# EAGLE schematic Adafruit nRF52 Bluefruit Feather (EAGLE 8.5.1)
COMPANY: ADAFRUIT INDUSTRIES; DRAWN: KTOWN; REV: F
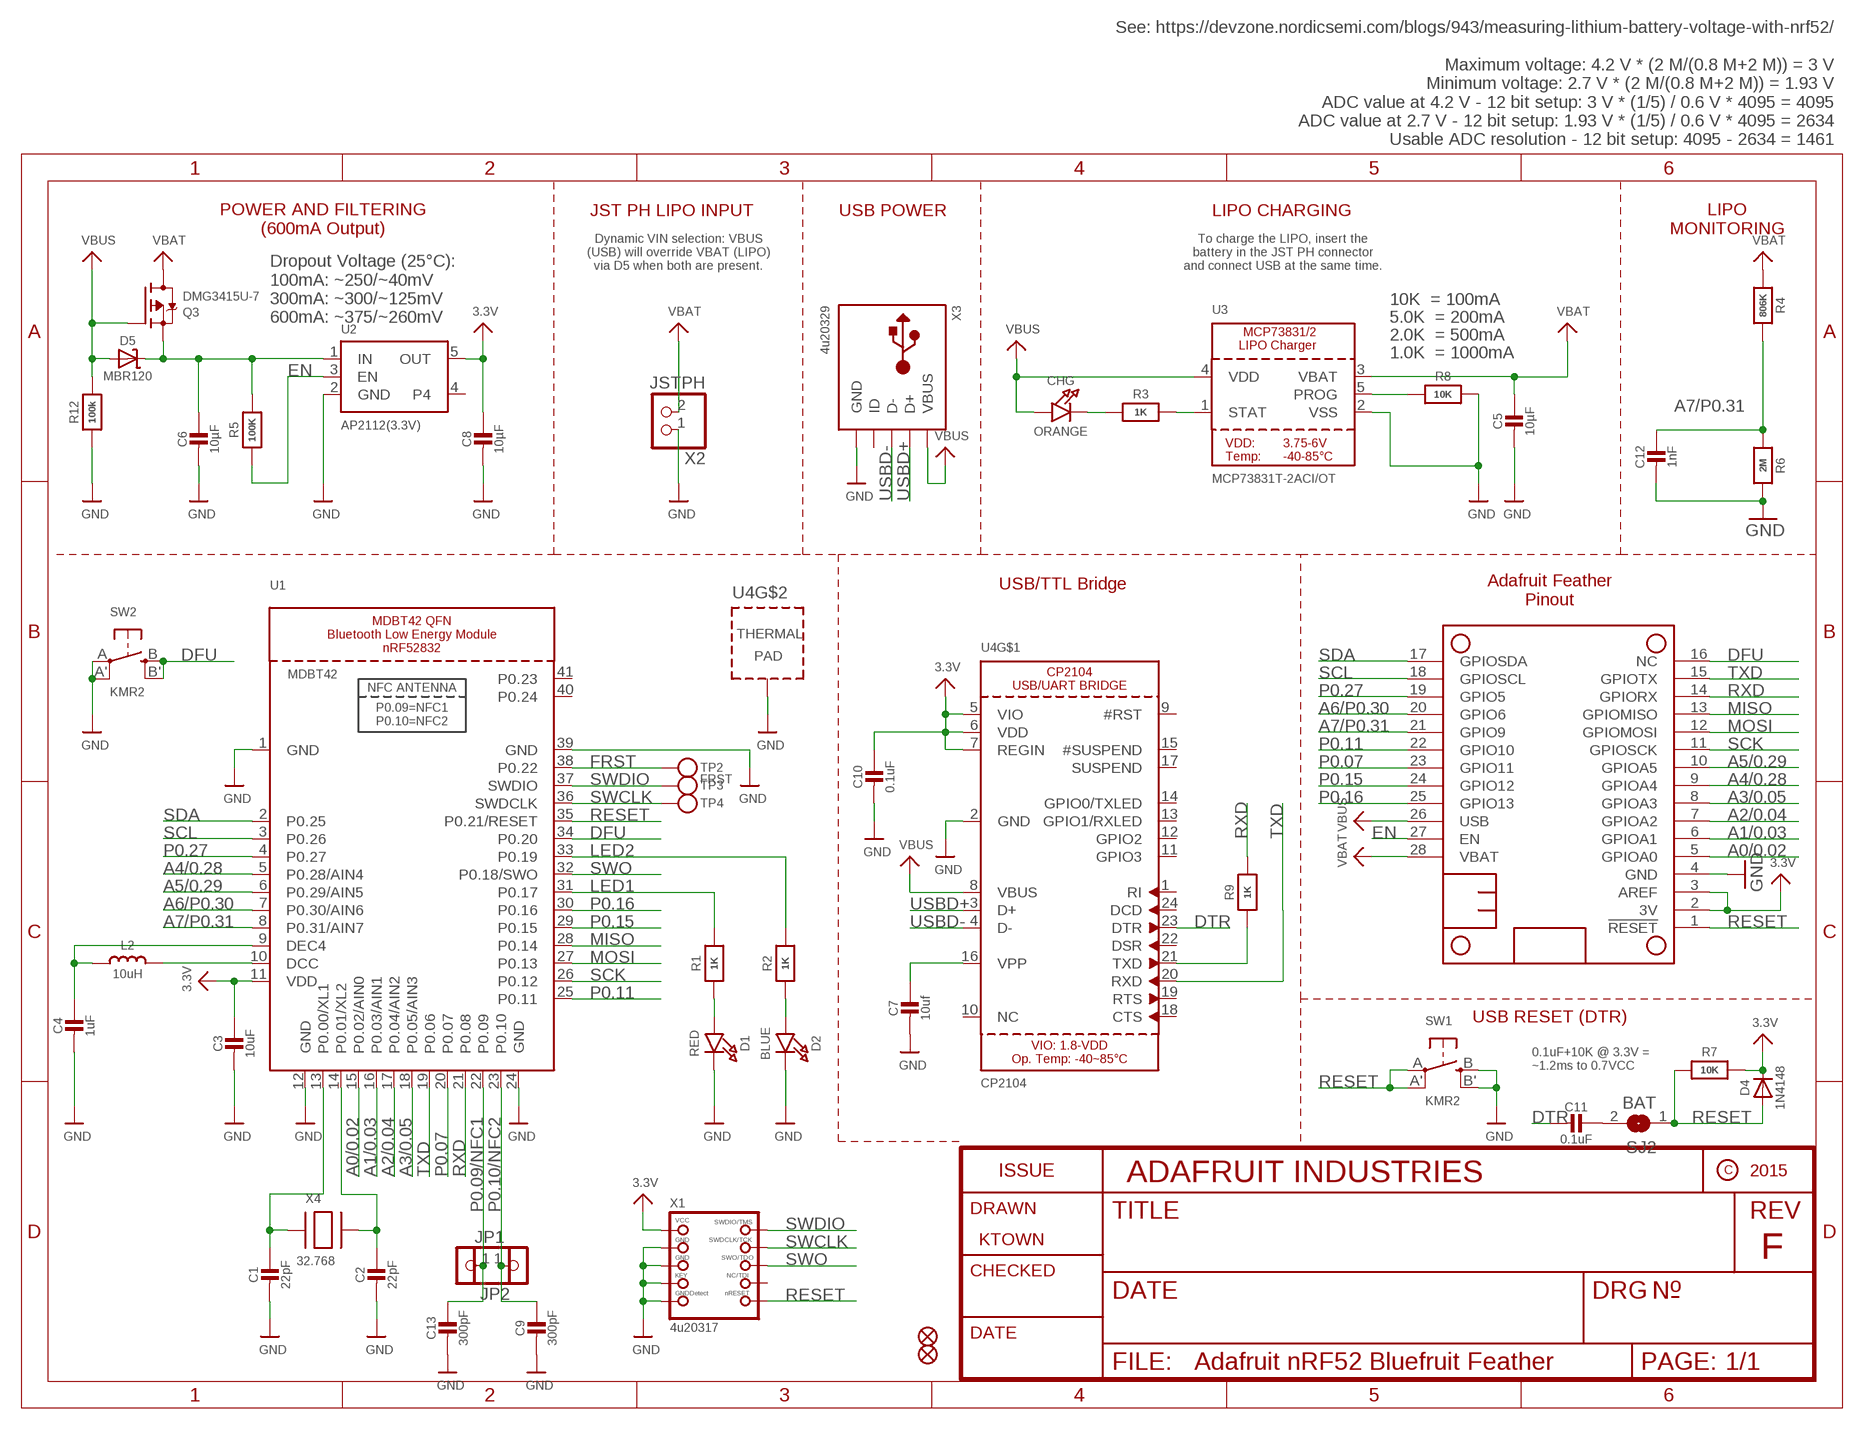
[diagram p0: schematic, sheet 1]

## Parts
C1  22pF  CAP_CERAMIC0603_NO  [0603-NO]
C2  22pF  CAP_CERAMIC0603_NO  [0603-NO]
C3  10uF  CAP_CERAMIC0805-NOOUTLINE  [0805-NO]
C4  1uF  CAP_CERAMIC0603_NO  [0603-NO]
C5  10µF  CAP_CERAMIC0805-NOOUTLINE  [0805-NO]
C6  10µF  CAP_CERAMIC0805-NOOUTLINE  [0805-NO]
C7  10uf  CAP_CERAMIC0805-NOOUTLINE  [0805-NO]
C8  10µF  CAP_CERAMIC0805-NOOUTLINE  [0805-NO]
C9  300pF  CAP_CERAMIC_0603MP  [_0603MP]
C10  0.1uF  CAP_CERAMIC0603_NO  [0603-NO]
C11  0.1uF  CAP_CERAMIC0603_NO  [0603-NO]
C12  1nF  CAP_CERAMIC0603_NO  [0603-NO]
C13  300pF  CAP_CERAMIC_0603MP  [_0603MP]
CHG  ORANGE  LED0805_NOOUTLINE  [CHIPLED_0805_NOOUTLINE]
D1  RED  LED0805_NOOUTLINE  [CHIPLED_0805_NOOUTLINE]
D2  BLUE  LED0805_NOOUTLINE  [CHIPLED_0805_NOOUTLINE]
D4  1N4148  DIODESOD-323  [SOD-323]
D5  MBR120  DIODE-SCHOTTKYSOD-123  [SOD-123]
FID1  FIDUCIAL_1MM  [FIDUCIAL_1MM]
FID3  FIDUCIAL_1MM  [FIDUCIAL_1MM]
JP1  HEADER-1X12MM  [1X01_2MM]
JP2  HEADER-1X12MM  [1X01_2MM]
L2  10uH  INDUCTOR0805-NO  [0805-NO]
MS1  FEATHERWING_NODIM  [FEATHERWING_NODIM]
Q3  DMG3415U-7  MOSFET-P  [SOT23-R]
R1  1K  RESISTOR_0603_NOOUT  [0603-NO]
R2  1K  RESISTOR_0603_NOOUT  [0603-NO]
R3  1K  RESISTOR_0603_NOOUT  [0603-NO]
R4  806K  RESISTOR_0603_NOOUT  [0603-NO]
R5  100K  RESISTOR_0603_NOOUT  [0603-NO]
R6  2M  RESISTOR_0603_NOOUT  [0603-NO]
R7  10K  RESISTOR_0603_NOOUT  [0603-NO]
R8  10K  RESISTOR_0603_NOOUT  [0603-NO]
R9  1K  RESISTOR_0603_NOOUT  [0603-NO]
R12  100k  RESISTOR_0603_NOOUT  [0603-NO]
SJ2  BAT  SOLDERJUMPERCLOSED  [SOLDERJUMPER_CLOSEDWIRE]
SW1  KMR2  SWITCH_TACT_SMT4.6X2.8  [BTN_KMR2_4.6X2.8]
SW2  KMR2  SWITCH_TACT_SMT4.6X2.8  [BTN_KMR2_4.6X2.8]
TP2  FRST  TESTPOINT1.5X2.0MM_NOCREAM  [PAD-1.5X2.0]
TP3  TESTPOINTROUND2MM  [TESTPOINT_ROUND_2MM]
TP4  TESTPOINTROUND2MM  [TESTPOINT_ROUND_2MM]
U1  MDBT42  NRF52832_MODULE_MDBT42  [BLE_MODULE_RAYTAC_MDBT42]
U2  AP2112(3.3V)  VREG_SOT23-5  [SOT23-5]
U3  MCP73831T-2ACI/OT  MCP73831/2  [SOT23-5]
U4  CP2104  [QFN24_4MM_SMSC]
X1  4u20317  JTAG-CORTEXBOXPOSTS  [2X05_1.27MM_BOX_POSTS]
X2  JSTPH  CON_JST_PH_2PIN  [JSTPH2]
X3  4u20329  USB_MICRO_20329_V2  [4UCONN_20329_V2]
X4  32.768  XTAL-3.2X1.5  [XTAL3215]

## Nets
3.3V: C3.1 C8.1 C10.1 D4.C MS1.2(3V) MS1.3(AREF) R7.2 U1.11(VDD) U2.5(OUT) U4.5(VIO) U4.6(VDD) U4.7(REGIN) X1.1(VCC)
A0/0.02: MS1.5(GPIOA0) U1.15(P0.02/AIN0)
A1/0.03: MS1.6(GPIOA1) U1.16(P0.03/AIN1)
A2/0.04: MS1.7(GPIOA2) U1.17(P0.04/AIN2)
A3/0.05: MS1.8(GPIOA3) U1.18(P0.05/AIN3)
A4/0.28: MS1.9(GPIOA4) U1.5(P0.28/AIN4)
A5/0.29: MS1.10(GPIOA5) U1.6(P0.29/AIN5)
A6/P0.30: MS1.20(GPIO6) U1.7(P0.30/AIN6)
A7/P0.31: C12.1 MS1.21(GPIO9) R4.2 R6.1 U1.8(P0.31/AIN7)
DFU: MS1.16(NC) SW2.B'(S1) SW2.B(S) U1.34(P0.20)
DTR: C11.2 U4.23(DTR)
EN: MS1.27(EN) R5.1 U2.3(EN)
FRST: TP2.P$1 U1.38(P0.22)
GND: C1.2 C2.2 C3.2 C4.2 C5.2 C6.2 C7.2 C8.2 C9.2 C10.2 C12.2 C13.2 D1.C D2.C MS1.4(GND) R6.2 R8.2 R12.1 SW1.B'(S1) SW1.B(S) SW2.A'(P1) SW2.A(P) U1.1(GND) U1.12(GND) U1.24(GND) U1.39(GND) U2.2(GND) U3.2(VSS) U4.2(GND) U4.THERM(TP) X1.3(GND) X1.5(GND) X1.7(KEY) X1.9(GNDDETECT) X2.1 X3.BASE@1(GND) X3.BASE@2(GND) X3.GND X3.SPRT@1(GND) X3.SPRT@2(GND) X3.SPRT@3(GND) X3.SPRT@4(GND)
LED1: R1.2 U1.31(P0.17)
LED2: R2.2 U1.33(P0.19)
MISO: MS1.13(GPIOMISO) U1.28(P0.14)
MOSI: MS1.12(GPIOMOSI) U1.27(P0.13)
N$1: C1.1 U1.13(P0.00/XL1) X4.P$1
N$2: C2.1 U1.14(P0.01/XL2) X4.P$2
N$3: L2.2 U1.10(DCC)
N$4: CHG.C R3.1
N$5: D1.A R1.1
N$7: D2.A R2.1
N$8: C4.1 L2.1 U1.9(DEC4)
N$9: R3.2 U3.1(STAT)
N$10: R8.1 U3.5(PROG)
N$11: R9.1 U4.21(TXD)
N$13: C11.1 SJ2.2
N$14: C7.1 U4.16(VPP)
P0.07: MS1.23(GPIO11) U1.20(P0.07)
P0.09/NFC1: C13.1 JP2.1 U1.22(P0.09)
P0.10/NFC2: C9.1 JP1.1 U1.23(P0.10)
P0.11: MS1.22(GPIO10) U1.25(P0.11)
P0.15: MS1.24(GPIO12) U1.29(P0.15)
P0.16: MS1.25(GPIO13) U1.30(P0.16)
P0.27: MS1.19(GPIO5) U1.4(P0.27)
RESET: D4.A MS1.1(!RESET) R7.1 SJ2.1 SW1.A'(P1) SW1.A(P) U1.35(P0.21/RESET) X1.10(NRESET)
RXD: MS1.14(GPIORX) R9.2 U1.21(P0.08)
SCK: MS1.11(GPIOSCK) U1.26(P0.12)
SCL: MS1.18(GPIOSCL) U1.3(P0.26)
SDA: MS1.17(GPIOSDA) U1.2(P0.25)
SWCLK: TP4.P$1 U1.36(SWDCLK) X1.4(SWDCLK)
SWDIO: TP3.P$1 U1.37(SWDIO) X1.2(SWDIO)
SWO: U1.32(P0.18/SWO) X1.6(SWO)
TXD: MS1.15(GPIOTX) U1.19(P0.06) U4.20(RXD)
USBD+: U4.3(D+) X3.D+
USBD-: U4.4(D-) X3.D-
VBAT: C5.1 MS1.28(VBAT) Q3.3(D) R4.1 U3.3(VBAT) X2.2
VBUS: CHG.A D5.A MS1.26(USB) Q3.1(G) R12.2 U3.4(VDD) U4.8(VBUS) X3.VBUS
VIN: C6.1 D5.C Q3.2(S) R5.2 U2.1(IN)
Unconnected: U1.40(P0.24) U1.41(P0.23) U2.4 U4.1(RI) U4.9(#RST) U4.10(NC) U4.11(GPIO3) U4.12(GPIO2) U4.13(GPIO1/RXLED) U4.14(GPIO0/TXLED) U4.15(#SUSPEND) U4.17(SUSPEND) U4.18(CTS) U4.19(RTS) U4.22(DSR) U4.24(DCD) X1.8(TDI) X3.ID

## Notes on the sheet
- See: https://devzone.nordicsemi.com/blogs/943/measuring-lithium-battery-voltage-with-nrf52/
  
  Maximum voltage: 4.2 V * (2 M/(0.8 M+2 M)) = 3 V
  Minimum voltage: 2.7 V * (2 M/(0.8 M+2 M)) = 1.93 V
  ADC value at 4.2 V - 12 bit setup: 3 V * (1/5) / 0.6 V * 4095 = 4095
  ADC value at 2.7 V - 12 bit setup: 1.93 V * (1/5) / 0.6 V * 4095 = 2634
  Usable ADC resolution - 12 bit setup: 4095 - 2634 = 1461
- JST PH LIPO INPUT | USB POWER | LIPO CHARGING
- POWER AND FILTERING
  (600mA Output)
- LIPO
  MONITORING
- Dynamic VIN selection: VBUS
  (USB) will override VBAT (LIPO)
  via D5 when both are present.
- To charge the LIPO, insert the
  battery in the JST PH connector
  and connect USB at the same time.
- 10K  = 100mA
- Dropout Voltage (25°C):
  100mA: ~250/~40mV
  300mA: ~300/~125mV
  600mA: ~375/~260mV
- 5.0K  = 200mA
- 2.0K  = 500mA
- 1.0K  = 1000mA
- USB/TTL Bridge
- Adafruit Feather
  Pinout
- USB RESET (DTR)
- 0.1uF+10K @ 3.3V =
  ~1.2ms to 0.7VCC

## Library data of the parts
C1-C13 = microbuilder:CAP_CERAMIC: Ceramic Capacitors For new designs, use the packages preceded by an '_' character since they are more reliable: The following footprints should be used on most boards: _0402 - Standard footprint for regular board layouts _0603 - Standard footprint for regular board layouts _0805 - Standard footprint for regular board layouts _1206 - Standard footprint for regular board layouts For extremely tight-pitch boards where space is at a premium, the following 'micro-pitch' footprints can be used (smaller pads, no silkscreen outline, etc.): _0402MP - Micro-pitch footprint for very dense/compact boards _0603MP - Micro-pitch footprint for very dense/compact boards _0805MP - Micro-pitch footprint for very dense/compact boards _1206MP - Micro-pitch footprint for very dense/compact boards
CHG D1 D2 = microbuilder:LED: LED 0603 - 0603 Surface Mount Package 2mA: Green LED - Low Power (3.9mcd, 2ma, 1.7Vf) - Digikey: 475-2709-2-ND Orange LED - Low Power (9.8mcd, 2ma, 1.8Vf) - Digikey: 475-1194-2-ND Red LED - Low Power (5mcd, 2ma, 1.8Vf) - Digikey: 475-1195-2-ND Yellow LED - Low Power (7mcd, 2ma, 1.8Vf) - Digikey: 475-1196-2-ND 5mA: Blue LED - Low Power (17mcd, 5ma, 2.9Vf) - Digikey: LNJ937W8CRACT-ND 0805 - 0805 Surface Mount Package 2mA: Red LED (8.8mcd, 2mA, 1.8Vf, Clear) - Low Power [Digikey: 475-2510-1-ND] Green LED (5mcd, 2mA, 1.8Vf, Clear) - Low Power [Digikey: 475-2730-1-ND] Yellow LED (11.3mcd, 2mA, 1.8Vf, Clear) - Low Power [Digikey: 475-2555-1-ND] 20mA: Red LED (104mcd, 20mA, Diffused) - LS R976 [Digikey: 475-1278-6-ND] Red LED (12mcd, 20mA, 2.0Vf, Clear) - APT2012EC [Digikey: 754-1128-1-ND] Green LED (15mcd, 20mA, 2.2Vf, Clear) - APT2012GC [Digikey: 754-1131-1-ND] Orange LED (160mcd, 20mA, 2.1Vf, Clear) - APT2012SECK [Digikey: 754-1130-1-ND] 1206 - 1206 Surface Mount Package Green LED (26mcd, 20mA, Diffused) - LG N971 [Digikey: 475-1407-6-ND] Red LED (15mcd, 20mA, Diffused) - LH N974 [Digikey: 475-1416-6-ND] Cree - Cree High-Power Surface Mount LEDs XPEBWT-L1-0000-00D50 - White 111lm 350mA 2.9Vf 6200K 110° XTEAWT-00-0000-00000LEE3 - White 114lm 350mA 2.85Vf 5000K 115° Everlight - Everlight 45-21 Series Surface Mount LEDs 45-21/QK2C-B2832AC2CB2/2T - Warm White 2000mcd 20mA 3.25Vf 3050K 120° 45-21/LK2C-B38452C4CB2/2T - Nuetral White 2000mcd 20mA 3.25Vf 4150K 120° 45-21/LK2C-B50634C6CB2/2T - Cold White 2200mcd 20mA 3.25Vf 5650K 120° PLCC2 Reverse Mount LS T77K-J1L2-1-0-2-R18-Z - Red 11.25mcd 2mA 1.8Vf 630nm 120° LO T77K-L1M2-24-Z - Orange 19.6mcd 2mA 1.8Vf 606nm 120° LY T77K-K2M1-26-Z - Yellow 15.7mcd 2mA 1.8Vf 587nm 120°
D4 = microbuilder:DIODE: Diode SMA Model Volts Amps Type Vf Ir Digikey # Notes SSA34-E3 40V 3A Schottky 480mV @ 3A 200uA @ 40V SSA34-E3/61TGITR-ND CDBA120-G 20V 1A Schottky 500mV @ 1A 500uA @ 20V 641-1014-6-ND REEL MBRA210 10V 2A Schottky 350mV @ 2A 700uA @ 10V MBRA210LT3 SOD-123 Model Volts Amps Type Vf Ir Order # Notes BAT54T1G 30V 200mA Schottky 800mV @ 200mA 2uA @ 25V BAT54T1GOSTR-ND B0530W 30V 500mA Schottky 430mV @ 500mA 130uA @ 30V B0530W-FDICT-ND REEL MBR120 20V 1A Schottky 340mV @ 1A MBR120VLSFT1GOSCT-ND SOD-323 Model Volts Amps Type Vf Ir Order # Notes PMEG2005EJ 20V 500mA Schottky 355mV @ 500mA 568-4110-1-ND ZLLS410 10V 570mA Schottky 380mV @ 570mA ZLLS410CT-ND 1N4148WS 75V 150mA Silicon/Simple 1V 1N4148WSFSCT-ND REEL SOD-523 Model Volts Amps Type Vf Ir Order # Notes BAT54XV2 30V 200mA Schottky 0.8V @ 100mA BAT54XV2CT-ND TB751S 30V 30mA Schottky RB751S-40TE61CT-ND SOT23-R/W (R = Solder Paste/Reflow Ovens, W = Hand-Soldering) Model Volts Amps Type Vf Ir Order # Notes BAT54FILM 40V 300mA Schottky 497-7162-1-ND POWERDI-5 Model Volts Amps Type Vf Ir Order # Notes PDS560 60V 5A Schottky 670mV @ 5A 150uA @ 60V PDS560DICT-ND
D5 = microbuilder:DIODE-SCHOTTKY
FID1 FID3 = microbuilder:FIDUCIAL: Fiducial Alignment Points Various fiducial points for machine vision alignment.; BOM: EXCLUDE
JP1 JP2 = microbuilder:HEADER-1X1: PIN HEADER
L2 = microbuilder:INDUCTOR: Inductors 0603: 10nH Ceramic Inductor - microwire antenna/RF (Digikey: 712-1434-2-ND) 0805: 560nH Ceramic Inductor - RF (Digikey: 553-1047-1-ND) 270nH Ceramic Inductor - Q = 40@250MHz, +-5%, 1 Ohm DC Resistance (Digikey: 535-10506-2-ND) 1007 (2518 Metric) SMT: 10µH 10% 250mOhm 820mA 1007 Inductor (Digikey: 587-2189-1-ND) 22µH 10% 500mOhm 580mA 1007 Inductor (Digikey: 587-2190-1-ND) 47µH 10% 950mOhm 420mA 1007 Inductor (Digikey: 587-2191-1-ND) 47µH 5% 100mOhm 1A 1008 Inductor (Digikey: 732-1816-1-ND) 5.0x5.0mm (Taiyo Yuden NR5040 Series) 6.8µH 20% 2.3A 64mOhm Inductor (Digikey: 587-2374-2-ND) 5.0x5.0mm (TDK VLC5045 Series) 4.7µH 20% 3.3A 34mOhm Inductor (Digikey: 445-6526-1-ND) 6.8µH 20% 2.7A 46mOhm Inductor (Digikey: 445-6527-1-ND) 6.0x6.0mm (TDK VLC6045 Series) 4.7µH 20% 3.8A 27mOhm Inductor (Digikey: 445-6538-2-ND) 6.8µH 20% 3A 41mOhm Inductor (Digikey: 445-6540-1-ND) 6.2µH 30% 2.2A 45mOhm Inductor (Digikey: SRR5028-6R2YCT-ND) - Not TDK VLC6045 but footprint should match 6.0x6.0mm (TDK SLF6045 Series) 6.8uH 30% 2A 33mOhm Inductor (Digikey: 445-4572-1-ND, Mouser: 810-SLF645T6R8N2R0PF) 6.0x6.0mm (Sumida CDRH5D28 Series) 6.2uH 30% 1.8A 45mOhm Inductor (Digikey: 308-1542-1-ND) Taiyo Yuden NR3015T2R2M - 2.2uH 20% 1.5A (Digikey: 587-1648-2-ND, Mouser: 963-NR3015T2R2M) - Used with TI TPS62172 CoilCraft RFID Transponder Coil - MA5532-AE (For use with AS3935 Lightning Sensor) Taiyo Yuden NRH2412T2R2MNGH - 2.2uH 20% 1AA (Digikey: 587-3443-1-ND) - Used with TI LM3671 Vishay IHLP 1.0uH Molded Inductor - 24mOhm DCR, 5A, +/-20%, -55°C-125°C (Digikey: 541-1319-1-ND)
MS1 = microbuilder:FEATHERWING
Q3 = microbuilder:MOSFET-P: P-Channel Mosfet LEGEND VDS: Voltage Drain-Source ID: Drain Current RDS(ON): Drain-Source On-State Resistance VGS(TH): Gate-Source Threshold Voltage CISS: Drain-Source Input Capacitance SOT-23 Name VDS ID RDS(ON) VGS(TH) CISS Order Number IRLML5103 30V 760mA 600 mOhm -- 75pF @ 25V Digikey: IRLML5103PBFCT-ND IRLML6401 12V 4.3A 50 mOhm 950mV @ 250µA 830pF @ 10V Digikey: IRLML6401PBFTR-ND NTR0202PL 20V 400mA 800 mOhm 2.3V @ 250uA 70pF @ 5V Digikey: NTR0202PLT1GOSTR-ND NTR4101PT1G 20V 1.8A 85 mOhm 1.2V @ 250uA 675pF @ 10V Digikey: NTR4101PT1GOSCT-ND DMP2004K 20V 600mA 900 mOhm 1V @ 250uA 175pF @ 16V Digikey: DMP2004KDICT-ND PMV65XP 20V 3.9A 76 mOhm 950mV @ 1mA 725pF @ 20V Digikey: 568-2358-2-ND TO-252 Name VDS ID RDS(ON) VGS(TH) CISS Order Number AOD417 30V 25A 34 mOhm 3V @ 250µA 920pF @ 15V Digikey: 785-1106-2-ND
R1-R9 R12 = microbuilder:RESISTOR: Resistors For new designs, use the packages preceded by an '_' character since they are more reliable: The following footprints should be used on most boards: _0402 - Standard footprint for regular board layouts _0603 - Standard footprint for regular board layouts _0805 - Standard footprint for regular board layouts _1206 - Standard footprint for regular board layouts For extremely tight-pitch boards where space is at a premium, the following 'micro-pitch' footprints can be used (smaller pads, no silkscreen outline, etc.): _0402MP - Micro-pitch footprint for very dense/compact boards _0603MP - Micro-pitch footprint for very dense/compact boards _0805MP - Micro-pitch footprint for very dense/compact boards _1206MP - Micro-pitch footprint for very dense/compact boards
SJ2 = microbuilder:SOLDERJUMPER: SMD Solder JUMPER Solder the two pads together to create a connection, or remove the solder to break it. REFLOW - Use this footprint for solder paste and reflow ovens. WAVE - Use this footprint for hand-soldering (larger pads). CLOSED - Has a trace between the two pads to ensure it is closed by default. The trace needs to be cut to disable the jumper, and can be closed again by creating a solder bridge between the two pads.
SW1 SW2 = microbuilder:SWITCH_TACT_SMT: SMT Tact Switches 6x6mm - Digikey: P12940SCT-ND KMR2 (4.6x2.8mm) - Digikey: 401-1426-1-ND EVQ-PQHB55 - Light Touch, 160GF (4.5x4.5mm) - Digikey: P8090SCT-ND KMT0 - KMT021 NGJ LHS (etc.) IP68/Waterproof - Digikey: CKN10289CT-ND
TP2-TP4 = microbuilder:TESTPOINT: Test Point Various test points for characterisation and PCB testing TESTPOINT_SMT - Compact Surface Mount Test Point [Digikey: 5016KTR-ND]
U1 = microbuilder:NRF52832_MODULE_MDBT42: MDBT42 - BLE Module (nRF52832 QFN) VDD: 1.7-3.6V
U2 = microbuilder:VREG_SOT23-5: SOT23-5 Fixed Voltage Regulators Part Current Out V Out V In V Dropout θJA (°C/W) TJ (°C) Digikey Part No. ADP121 150mA 3.3V 3.4-5.5V 0.09V @ 150mA -- -- ADP121-AUJZ33R7CT-ND ADP121 150mA 3.0V 3.1-5.5V 0.09V @ 150mA -- -- ADP121-AUJZ30R7CT-ND ADP122 300mA 3.3V 3.4-5.5V 0.085V @ 300mA -- -- ADP122AUJZ-3.3-R7CT-ND ADP1712 300mA 3.3V 3.5-5.5V 0.17V @ 300mA -- -- ADP1712AUJZ-3.3-R7TR-ND AP7311 (Low Cost) 150mA 3.3V 3.5-6V 0.15V @ 150mA -- -- AP7311-33WG-7DICT-ND LD39015M18R 150mA 1.8V 1.9V-5.5V 0.08V @ 100mA -- -- 497-6977-1-ND LP2985A-33DBVR 150mA 3.3V 3.3-16V 0.28V @ 150mA 206 150 296-18479-1-ND MCP1824T-3302E/OT 300mA 3.3V 3.5V-6V 0.2V @ 300mA -- -- MCP1824T-3302E/OTCT-ND MIC5205-2.5YM5 TR 150mA 2.5V 2.7-16V 0.165V @ 150mA -- -- 576-1257-2-ND MIC5205-3.0YM5 TR 150mA 3.0V 3.2V-16V 0.165V @ 150mA -- -- 576-1258-2-ND MIC5205-3.3YM5 TR 150mA 3.3V 3.5V-16V 0.165V @ 150mA -- -- 576-1259-2-ND TPS780330220 150mA 3.3V+2.2V 3.6-5.5V 250mV Max -- -- 296-23332-1-ND TDA3663/N1,135 100mA 3.3V 3.5-45V 0.18V @ 50mA -- -- 568-5343-1-ND Max operating temp can be calculated using θJA, TJ (max junction temperature), and power in watts. Set the "Maximum Ambient Temperature" until it reaches TJ ("Max Junction Temperature"), which is the absolute limit for safe use of the regulator: Heat Sink Temperature Calculator <http://www.daycounter.com/Calculators/Heat-Sink-Temperature-Calculator.phtml> For example, With 12V source into a 3.3V LP2985 and a 30mA load, we are dissipating (12V-3.3V) * 0.03A = 0.261W. With a θJA of 206 °C/W, a TJ of 150°C, and 261mW we can safely use the chip without a heat sink up to 75°C (=147.1°C Junction Temperature).
U3 = microbuilder:MCP73831/2: MCP73831/2 LIPO Charger VDD: 3.75 - 6V Temp -40 - 85°C Programmable Charge Rate: 15-500mA NOTE: STAT is a tri-state logic output on the MCP73831 and an open-drain output on the MCP73832. SOT23-5 with 4.2V output and tri-state logic on STAT = MCP73831T-2ACI/OT
U4 = microbuilder:CP2104: CP2104 - USB to UART Bridge VDD Output: 3.45V
X1 = microbuilder:JTAG-CORTEX: Serial Wire (SW-DP) Connector Standard 0.05" 10-pin connector is for use with the Cortex M and Cortex A SWD (serial wire debugger) interface (SW-DP) Connectors 2x05_1.27MM_SMT - Inexpensive surface-mount header with bare pins, compatible with standard 10-pin SWD cables (4UCON: 16846) 2x05_1.27MM_BOX_NOPOSTS - Polarised surface-mount box (4UCON with caps: 19735, without caps: 15117 2x05_1.27MM_BOX_POSTS - Polarised surface-mount box with mounting holes (4UCON: 20317) Pinout: http://infocenter.arm.com/help/topic/com.arm.doc.faqs/attached/13634/cortex_debug_connectors.pdf http://www.keil.com/peripherals/coresight/connectors.asp
X2 = microbuilder:CON_JST_PH_2PIN: JST 2-Pin Right-Angle Connector PH-Series - 4UConnector: 17311 SH-Series - 4UConnector: 07278
X3 = microbuilder:USB: USB Connectors USBMINIB - Surface Mount Female Mini-B USB Connector 4UConnector: 06564
X4 = adafruit2:XTAL: Low cost SMT crystals, no capacitors included http://www.ladyada.net/library/eagle

## Net classes
3 usbvcc: width 0.305 mm, drill 0.483 mm, clearance 0.203 mm